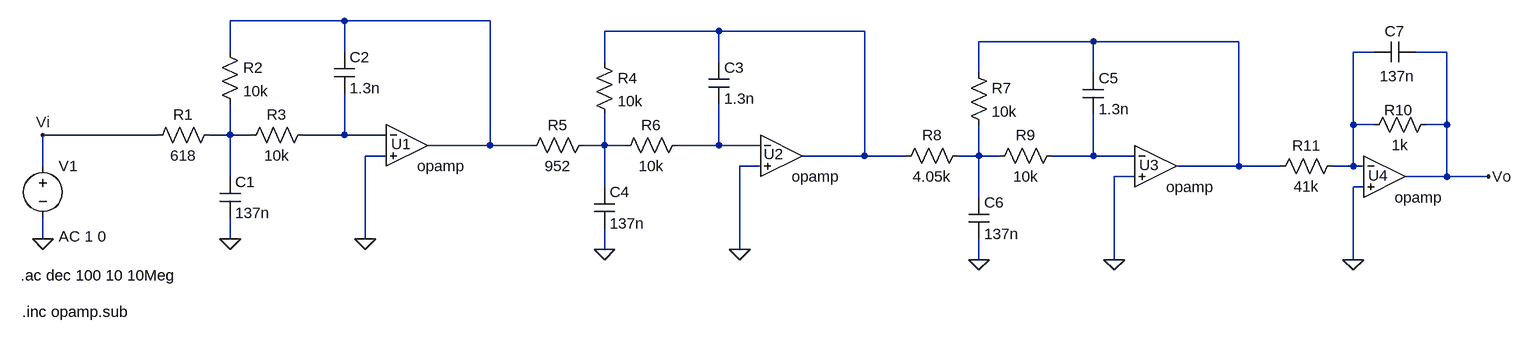
[diagram p0: schematic Ej_3d.asc]
Ej_3d.asc, the LTspice schematic file:
Version 4
SHEET 1 2096 680
WIRE 288 -112 112 -112
WIRE 512 -112 288 -112
WIRE 864 -96 688 -96
WIRE 1088 -96 864 -96
WIRE 1440 -80 1264 -80
WIRE 1664 -80 1440 -80
WIRE 112 -64 112 -112
WIRE 288 -64 288 -112
WIRE 1872 -64 1840 -64
WIRE 1984 -64 1936 -64
WIRE 688 -48 688 -96
WIRE 864 -48 864 -96
WIRE 1264 -32 1264 -80
WIRE 1440 -32 1440 -80
WIRE 1840 48 1840 -64
WIRE 1872 48 1840 48
WIRE 1984 48 1984 -64
WIRE 1984 48 1952 48
WIRE 0 64 -176 64
WIRE 112 64 112 16
WIRE 112 64 80 64
WIRE 144 64 112 64
WIRE 288 64 288 0
WIRE 288 64 224 64
WIRE 352 64 288 64
WIRE 512 80 512 -112
WIRE 512 80 416 80
WIRE 576 80 512 80
WIRE 688 80 688 32
WIRE 688 80 656 80
WIRE 720 80 688 80
WIRE 864 80 864 16
WIRE 864 80 800 80
WIRE 928 80 864 80
WIRE 352 96 320 96
WIRE 1088 96 1088 -96
WIRE 1088 96 992 96
WIRE 1152 96 1088 96
WIRE 1264 96 1264 48
WIRE 1264 96 1232 96
WIRE 1296 96 1264 96
WIRE 1440 96 1440 32
WIRE 1440 96 1376 96
WIRE 1504 96 1440 96
WIRE -176 112 -176 64
WIRE 928 112 896 112
WIRE 1664 112 1664 -80
WIRE 1664 112 1568 112
WIRE 1728 112 1664 112
WIRE 1840 112 1840 48
WIRE 1840 112 1808 112
WIRE 1856 112 1840 112
WIRE 112 128 112 64
WIRE 1504 128 1472 128
WIRE 1984 128 1984 48
WIRE 1984 128 1920 128
WIRE 2048 128 1984 128
WIRE 688 144 688 80
WIRE 1856 144 1840 144
WIRE 1264 160 1264 96
WIRE -176 224 -176 192
WIRE 112 224 112 192
WIRE 320 224 320 96
WIRE 688 240 688 208
WIRE 896 240 896 112
WIRE 1264 256 1264 224
WIRE 1472 256 1472 128
WIRE 1840 256 1840 144
FLAG 320 224 0
FLAG 112 224 0
FLAG 896 240 0
FLAG 688 240 0
FLAG 1472 256 0
FLAG 1264 256 0
FLAG -176 224 0
FLAG 1840 256 0
FLAG 2048 128 Vo
FLAG -176 64 Vi
SYMBOL voltage -176 96 R0
WINDOW 123 24 124 Left 2
WINDOW 39 0 0 Left 0
SYMATTR InstName V1
SYMATTR Value ""
SYMATTR Value2 AC 1 0
SYMBOL OpAmps\\opamp 384 16 R0
WINDOW 0 -24 62 Left 2
SYMATTR InstName U1
SYMBOL res 96 -80 R0
SYMATTR InstName R2
SYMATTR Value 10k
SYMBOL res 96 48 R90
WINDOW 0 0 56 VBottom 2
WINDOW 3 32 56 VTop 2
SYMATTR InstName R1
SYMATTR Value 618
SYMBOL res 240 48 R90
WINDOW 0 0 56 VBottom 2
WINDOW 3 32 56 VTop 2
SYMATTR InstName R3
SYMATTR Value 10k
SYMBOL cap 272 -64 R0
SYMATTR InstName C2
SYMATTR Value 1.3n
SYMBOL cap 96 128 R0
SYMATTR InstName C1
SYMATTR Value 137n
SYMBOL OpAmps\\opamp 960 32 R0
WINDOW 0 -27 61 Left 2
SYMATTR InstName U2
SYMBOL res 672 -64 R0
SYMATTR InstName R4
SYMATTR Value 10k
SYMBOL res 672 64 R90
WINDOW 0 0 56 VBottom 2
WINDOW 3 32 56 VTop 2
SYMATTR InstName R5
SYMATTR Value 952
SYMBOL res 816 64 R90
WINDOW 0 0 56 VBottom 2
WINDOW 3 32 56 VTop 2
SYMATTR InstName R6
SYMATTR Value 10k
SYMBOL cap 848 -48 R0
SYMATTR InstName C3
SYMATTR Value 1.3n
SYMBOL cap 672 144 R0
SYMATTR InstName C4
SYMATTR Value 137n
SYMBOL OpAmps\\opamp 1536 48 R0
WINDOW 0 -25 62 Left 2
SYMATTR InstName U3
SYMBOL res 1248 -48 R0
SYMATTR InstName R7
SYMATTR Value 10k
SYMBOL res 1248 80 R90
WINDOW 0 0 56 VBottom 2
WINDOW 3 32 56 VTop 2
SYMATTR InstName R8
SYMATTR Value 4.05k
SYMBOL res 1392 80 R90
WINDOW 0 0 56 VBottom 2
WINDOW 3 32 56 VTop 2
SYMATTR InstName R9
SYMATTR Value 10k
SYMBOL cap 1424 -32 R0
SYMATTR InstName C5
SYMATTR Value 1.3n
SYMBOL cap 1248 160 R0
SYMATTR InstName C6
SYMATTR Value 137n
SYMBOL OpAmps\\opamp 1888 64 R0
WINDOW 0 -25 62 Left 2
SYMATTR InstName U4
SYMBOL cap 1936 -80 R90
WINDOW 0 0 32 VBottom 2
WINDOW 3 38 28 VTop 2
SYMATTR InstName C7
SYMATTR Value 137n
SYMBOL res 1968 32 R90
WINDOW 0 9 58 VBottom 2
WINDOW 3 32 56 VTop 2
SYMATTR InstName R10
SYMATTR Value 1k
SYMBOL res 1712 128 R270
WINDOW 0 32 56 VTop 2
WINDOW 3 0 56 VBottom 2
SYMATTR InstName R11
SYMATTR Value 41k
TEXT -210 280 Left 2 !.ac dec 100 10 10Meg
TEXT -208 336 Left 2 !.inc opamp.sub

The netlist it stands for:
* Ej_3d.asc
V1 Vi 0 AC 1 0
XU1 N006 0 N001 opamp Aol=100K GBW=10Meg  ; pins invin noninvin out
R2 N001 N005 10k
R1 N005 Vi 618
R3 N006 N005 10k
C2 N001 N006 1.3n
C1 N005 0 137n
XU2 N008 0 N002 opamp Aol=100K GBW=10Meg  ; pins invin noninvin out
R4 N002 N007 10k
R5 N007 N001 952
R6 N008 N007 10k
C3 N002 N008 1.3n
C4 N007 0 137n
XU3 N010 0 N003 opamp Aol=100K GBW=10Meg  ; pins invin noninvin out
R7 N003 N009 10k
R8 N009 N002 4.05k
R9 N010 N009 10k
C5 N003 N010 1.3n
C6 N009 0 137n
XU4 N004 0 Vo opamp Aol=100K GBW=10Meg  ; pins invin noninvin out
C7 Vo N004 137n
R10 Vo N004 1k
R11 N003 N004 41k
.ac dec 100 10 10Meg
.inc opamp.sub
.backanno
.end